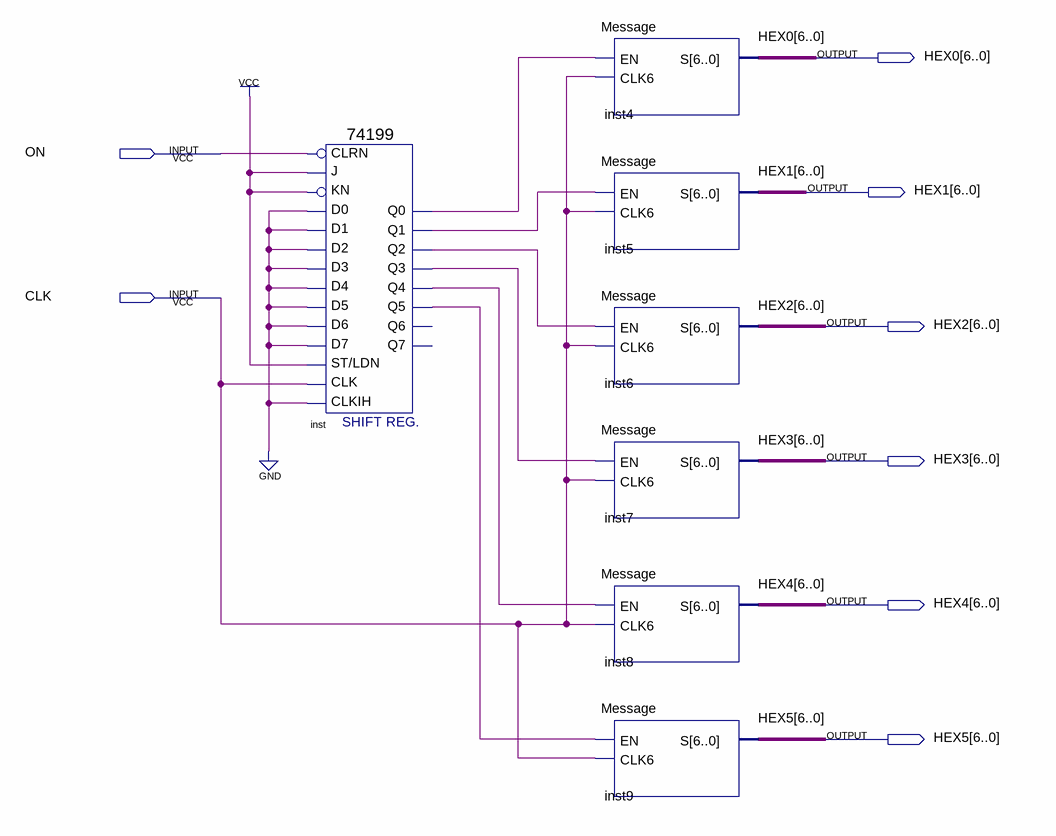
[diagram p0: schematic sheet]
// Quartus schematic Project12.bdf as structural Verilog: 7 symbols, 8 pins
module Project12 (
  input  ON,
  input  CLK,
  output [6:0] HEX0,
  output [6:0] HEX1,
  output [6:0] HEX2,
  output [6:0] HEX3,
  output [6:0] HEX4,
  output [6:0] HEX5
);

  wire inst_q0, inst_q1, inst_q2, inst_q3, inst_q4, inst_q5;

  \74199  inst (
    .KN(1'b1), .CLRN(ON), .\ST/LDN (1'b1), .CLK(CLK), .J(1'b1), .D3(1'b0), .D2(1'b0), .D1(1'b0), .D0(1'b0),
    .D7(1'b0), .D6(1'b0), .CLKIH(1'b0), .D4(1'b0), .D5(1'b0), .Q5(inst_q5), .Q2(inst_q2), .Q3(inst_q3),
    .Q4(inst_q4), .Q0(inst_q0), .Q1(inst_q1));  // open: Q6, Q7
  Message inst4 (.EN(inst_q0), .CLK6(CLK), .S(HEX0));
  Message inst5 (.EN(inst_q1), .CLK6(CLK), .S(HEX1));
  Message inst6 (.EN(inst_q2), .CLK6(CLK), .S(HEX2));
  Message inst7 (.EN(inst_q3), .CLK6(CLK), .S(HEX3));
  Message inst8 (.EN(inst_q4), .CLK6(CLK), .S(HEX4));
  Message inst9 (.EN(inst_q5), .CLK6(CLK), .S(HEX5));
endmodule
